# Altium schematic sheet Sheet1.SchDoc
size B
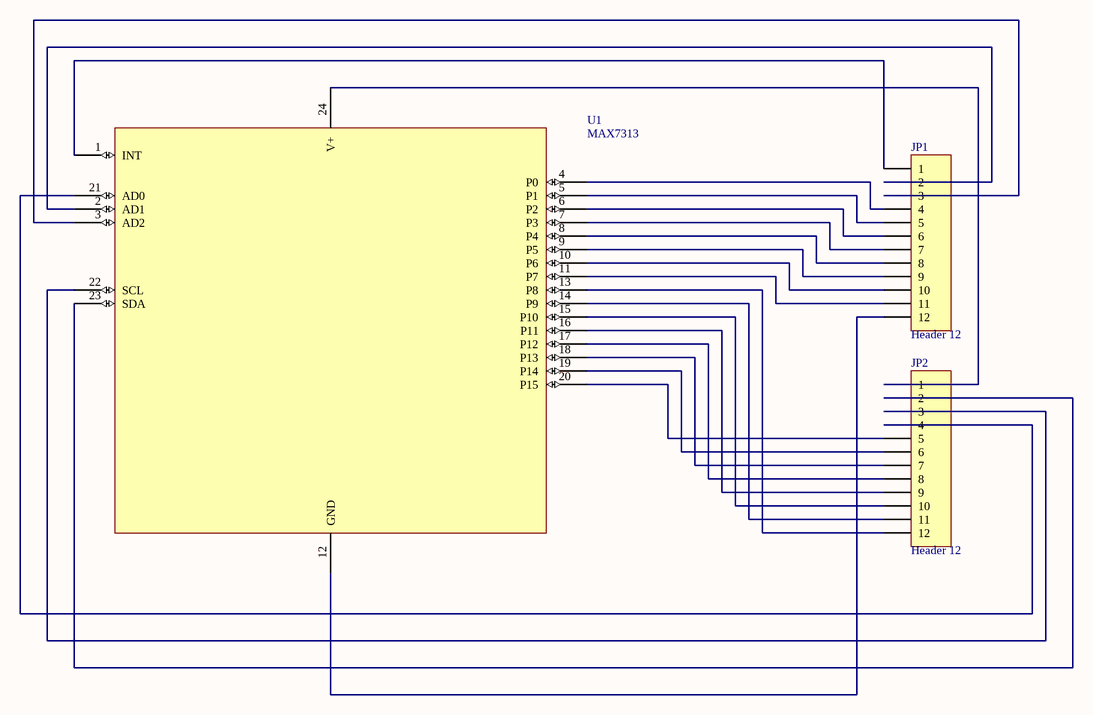
[diagram p0: Sheet1.SchDoc]

## Parts
JP1  Header 12  [HDR1X12]
JP2  Header 12  [HDR1X12]
U1  MAX7313  [QSOP24]

## Nets
NetJP1_1: JP1.1 U1.1(INT)
NetJP1_2: JP1.2 U1.2(AD1)
NetJP1_3: JP1.3 U1.3(AD2)
NetJP1_4: JP1.4 U1.4(P0)
NetJP1_5: JP1.5 U1.5(P1)
NetJP1_6: JP1.6 U1.6(P2)
NetJP1_7: JP1.7 U1.7(P3)
NetJP1_8: JP1.8 U1.8(P4)
NetJP1_9: JP1.9 U1.9(P5)
NetJP1_10: JP1.10 U1.10(P6)
NetJP1_11: JP1.11 U1.11(P7)
NetJP1_12: JP1.12 U1.12(GND)
NetJP2_1: JP2.1 U1.24(V+)
NetJP2_2: JP2.2 U1.23(SDA)
NetJP2_3: JP2.3 U1.22(SCL)
NetJP2_4: JP2.4 U1.21(AD0)
NetJP2_5: JP2.5 U1.20(P15)
NetJP2_6: JP2.6 U1.19(P14)
NetJP2_7: JP2.7 U1.18(P13)
NetJP2_8: JP2.8 U1.17(P12)
NetJP2_9: JP2.9 U1.16(P11)
NetJP2_10: JP2.10 U1.15(P10)
NetJP2_11: JP2.11 U1.14(P9)
NetJP2_12: JP2.12 U1.13(P8)

## Library data of the parts
JP1 JP2 = Header 12: Header, 12-Pin; Manufacturer: Generic Components; Class: Connector